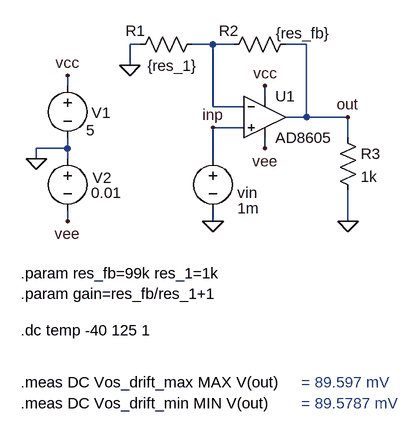
[diagram p0: schematic 04-AD8605 delta_Vos invert amplifier.asc]
04-AD8605 delta_Vos invert amplifier.asc, the LTspice schematic file:
Version 4
SHEET 1 880 680
WIRE -64 -128 -80 -128
WIRE 48 -128 16 -128
WIRE 80 -128 48 -128
WIRE 192 -128 160 -128
WIRE -80 -96 -80 -128
WIRE -176 -64 -176 -80
WIRE 128 -48 128 -64
WIRE 48 -32 48 -128
WIRE 96 -32 48 -32
WIRE 192 -16 192 -128
WIRE 192 -16 160 -16
WIRE 256 -16 192 -16
WIRE 96 0 48 0
WIRE 256 16 256 -16
WIRE -176 32 -176 16
WIRE -176 32 -224 32
WIRE 128 32 128 16
WIRE -224 48 -224 32
WIRE -176 48 -176 32
WIRE 48 48 48 0
WIRE -176 144 -176 128
WIRE 48 144 48 128
WIRE 256 144 256 96
FLAG -176 -80 vcc
FLAG 128 -64 vcc
FLAG 48 144 0
FLAG 256 144 0
FLAG 256 -16 out
FLAG 48 0 inp
FLAG -224 48 0
FLAG -176 144 vee
FLAG 128 32 vee
FLAG -80 -96 0
SYMBOL Opamps\\AD8605 128 -80 R0
SYMATTR InstName U1
SYMBOL voltage -176 -80 R0
WINDOW 123 0 0 Left 0
WINDOW 39 0 0 Left 0
WINDOW 0 37 57 Left 2
WINDOW 3 29 84 Left 2
SYMATTR InstName V1
SYMATTR Value 5
SYMBOL voltage 48 32 R0
WINDOW 123 0 0 Left 0
WINDOW 39 0 0 Left 0
WINDOW 0 38 68 Left 2
WINDOW 3 38 92 Left 2
SYMATTR InstName vin
SYMATTR Value 1m
SYMBOL res 240 0 R0
SYMATTR InstName R3
SYMATTR Value 1k
SYMBOL voltage -176 32 R0
WINDOW 123 0 0 Left 0
WINDOW 39 0 0 Left 0
WINDOW 0 39 45 Left 2
WINDOW 3 36 68 Left 2
SYMATTR InstName V2
SYMATTR Value 0.01
SYMBOL res 176 -144 R90
WINDOW 0 11 103 VBottom 2
WINDOW 3 -17 -11 VTop 2
SYMATTR InstName R2
SYMATTR Value {res_fb}
SYMBOL res 32 -144 R90
WINDOW 0 11 103 VBottom 2
WINDOW 3 33 46 VTop 2
SYMATTR InstName R1
SYMATTR Value {res_1}
TEXT -248 224 Left 2 !.param res_fb=99k res_1=1k
TEXT -248 256 Left 2 !.param gain=res_fb/res_1+1
TEXT -248 312 Left 2 !.dc temp -40 125 1
TEXT -248 424 Left 2 !.meas DC Vos_drift_min MIN V(out)
TEXT 184 424 Left 2 ;= 89.5787 mV
TEXT -248 392 Left 2 !.meas DC Vos_drift_max MAX V(out)
TEXT 184 392 Left 2 ;= 89.597 mV

The netlist it stands for:
* 04-AD8605 delta_Vos invert amplifier.asc
XU1 inp N001 vcc vee out AD8605  ; pins In+ In- V+ V- OUT
V1 vcc 0 5
vin inp 0 1m
R3 out 0 1k
V2 0 vee 0.01
R2 out N001 {res_fb}
R1 N001 0 {res_1}
.param res_fb=99k res_1=1k
.param gain=res_fb/res_1+1
.dc temp -40 125 1
.meas DC Vos_drift_min MIN V(out)
* = 89.5787 mV
.meas DC Vos_drift_max MAX V(out)
* = 89.597 mV
.lib ADI.lib
.backanno
.end

* Results of the author's LTspice run, read from the files saved beside the schematic
* From the log:
*   vos_drift_min: MIN(v(out))=0.0895787 FROM -40 TO 125
*   vos_drift_max: MAX(v(out))=0.089597 FROM -40 TO 125